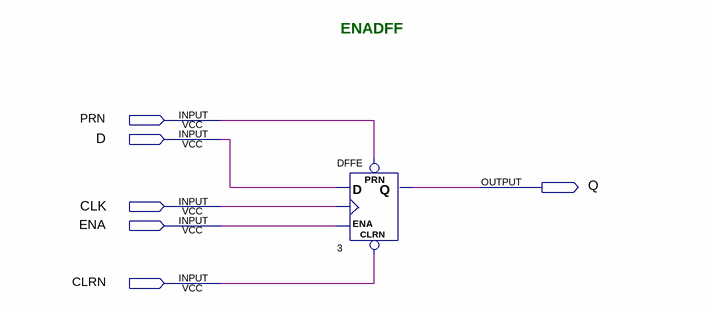
[diagram p0: schematic sheet]
// Quartus schematic enadff.bdf as structural Verilog: 1 symbols, 6 pins
module enadff (
  input  PRN,
  input  D,
  input  CLK,
  input  ENA,
  input  CLRN,
  output Q
);

  DFFE u_3 (.PRN(PRN), .CLRN(CLRN), .D(D), .CLK(CLK), .ENA(ENA), .Q(Q));

  // Notes on the sheet:
  //   ENADFF
endmodule
